# EAGLE design birthdaydisplay (EAGLE 6.5.0)
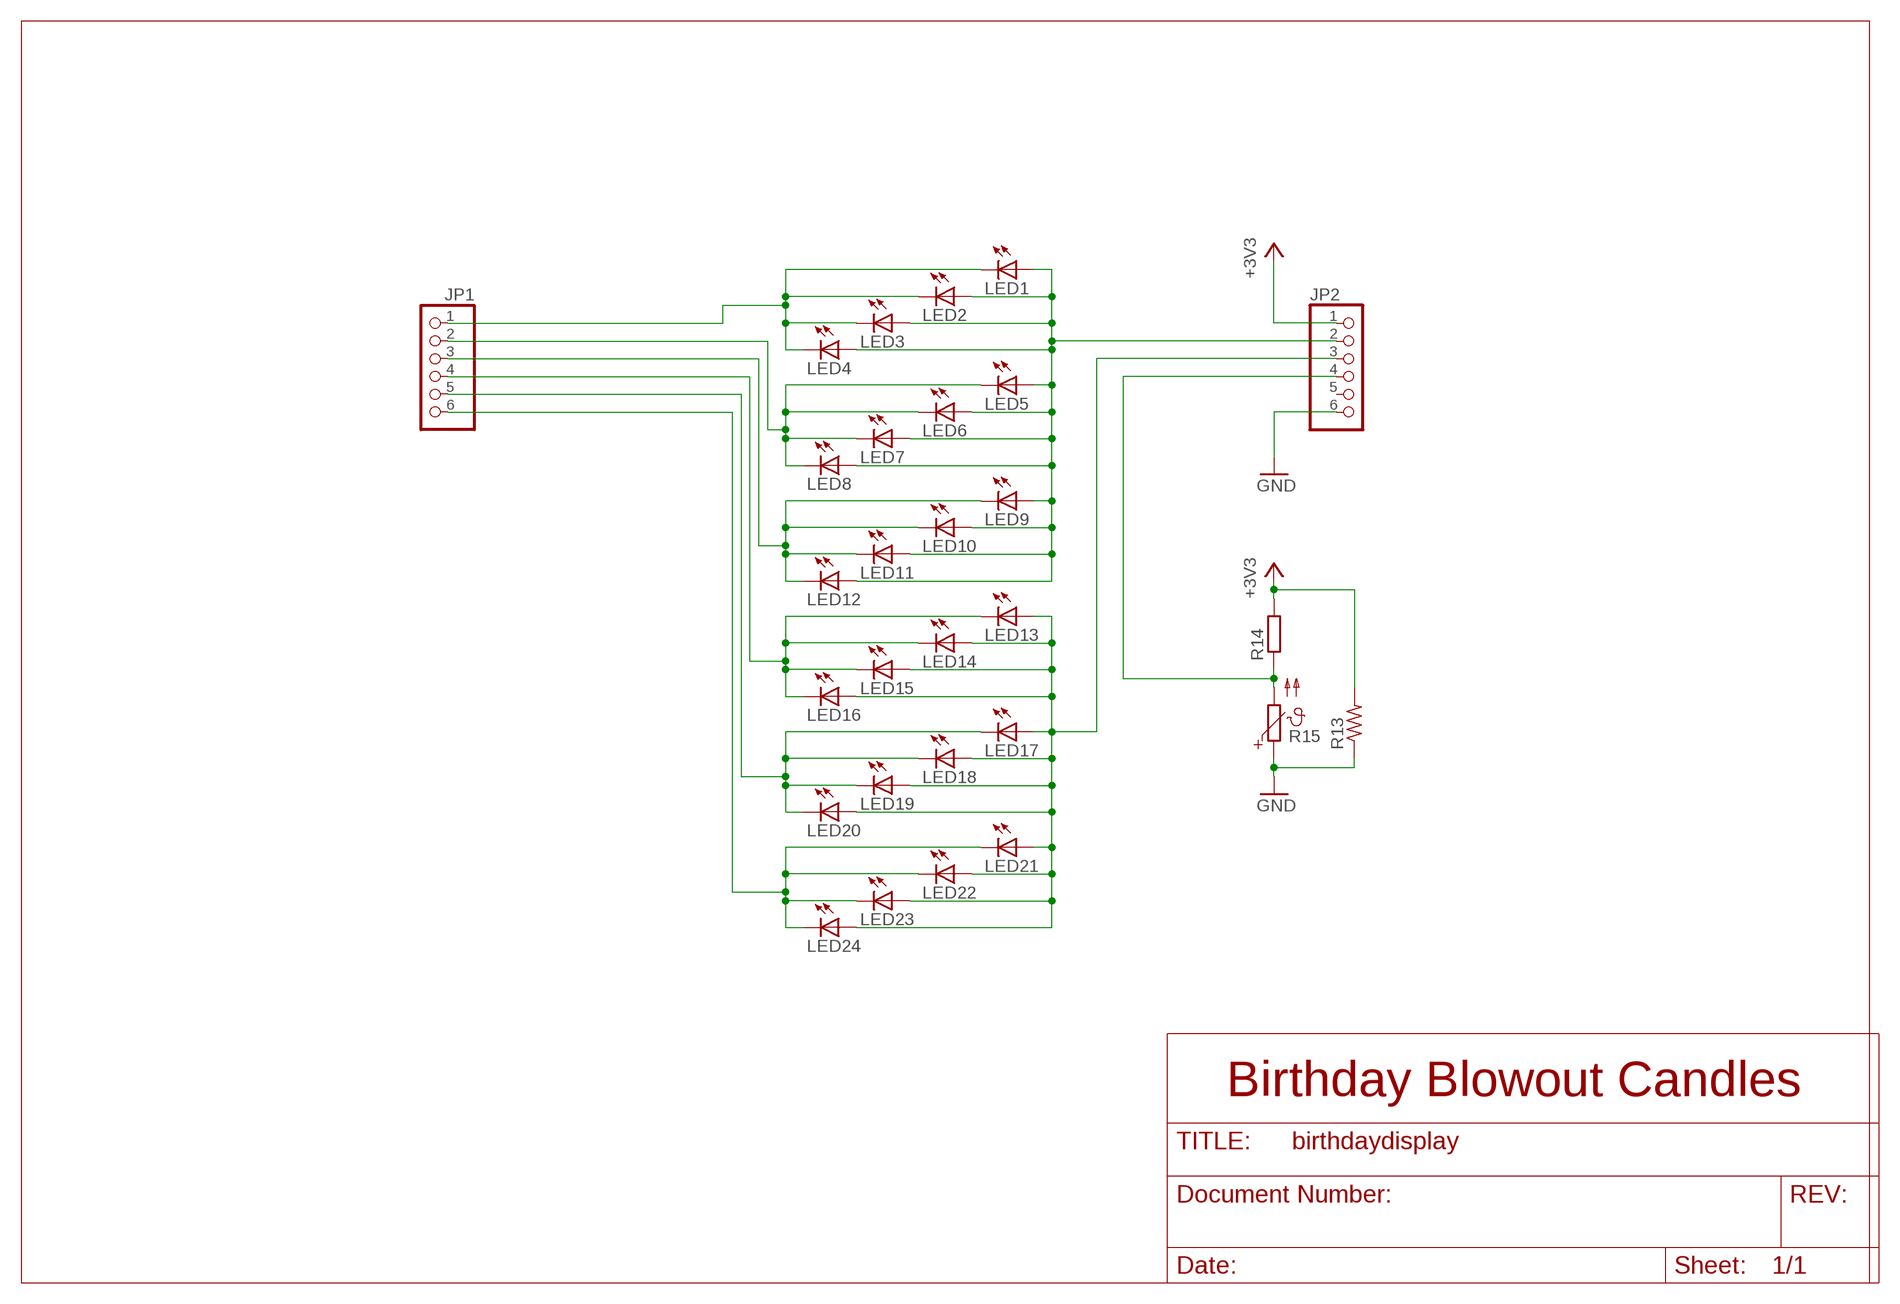
[diagram p0: schematic, sheet 1]

## Parts
JP1  PINHD-1X6  [1X06]
JP2  PINHD-1X6  [1X06]
LED1  LED3MM  [LED3MM]
LED2  LED3MM  [LED3MM]
LED3  LED3MM  [LED3MM]
LED4  LED3MM  [LED3MM]
LED5  LED3MM  [LED3MM]
LED6  LED3MM  [LED3MM]
LED7  LED3MM  [LED3MM]
LED8  LED3MM  [LED3MM]
LED9  LED3MM  [LED3MM]
LED10  LED3MM  [LED3MM]
LED11  LED3MM  [LED3MM]
LED12  LED3MM  [LED3MM]
LED13  LED3MM  [LED3MM]
LED14  LED3MM  [LED3MM]
LED15  LED3MM  [LED3MM]
LED16  LED3MM  [LED3MM]
LED17  LED3MM  [LED3MM]
LED18  LED3MM  [LED3MM]
LED19  LED3MM  [LED3MM]
LED20  LED3MM  [LED3MM]
LED21  LED3MM  [LED3MM]
LED22  LED3MM  [LED3MM]
LED23  LED3MM  [LED3MM]
LED24  LED3MM  [LED3MM]
R13  R-US_0207/10  [0207/10]
R14  R-EU_0207/7  [0207/7]
R15  PTC679  [P679]

## Nets
+3V3: JP2.1 R13.2 R14.2
GND: JP2.6 R13.1 R15.1
N$24: JP1.4 LED13.K(C) LED14.K(C) LED15.K(C) LED16.K(C)
N$28: JP2.4 R14.1 R15.2
N$33: JP1.1 LED1.K(C) LED2.K(C) LED3.K(C) LED4.K(C)
N$35: JP1.2 LED5.K(C) LED6.K(C) LED7.K(C) LED8.K(C)
N$36: JP2.2 LED1.A LED2.A LED3.A LED4.A LED5.A LED6.A LED7.A LED8.A LED9.A LED10.A LED11.A LED12.A
N$37: JP1.3 LED9.K(C) LED10.K(C) LED11.K(C) LED12.K(C)
N$39: JP1.5 LED17.K(C) LED18.K(C) LED19.K(C) LED20.K(C)
N$40: JP2.3 LED13.A LED14.A LED15.A LED16.A LED17.A LED18.A LED19.A LED20.A LED21.A LED22.A LED23.A LED24.A
N$41: JP1.6 LED21.K(C) LED22.K(C) LED23.K(C) LED24.K(C)
Unconnected: JP2.5

## Notes on the sheet
- Birthday Blowout Candles

## Library data of the parts
JP1 JP2 = pinhead01:PINHD-1X6: PIN HEADER
LED1-LED24 = led:LED: LED OSRAM: - CHIPLED LG R971, LG N971, LY N971, LG Q971, LY Q971, LO R971, LY R971 LH N974, LH R974 LS Q976, LO Q976, LY Q976 LO Q996 - Hyper CHIPLED LW Q18S LB Q993, LB Q99A, LB R99A - SideLED LS A670, LO A670, LY A670, LG A670, LP A670 LB A673, LV A673, LT A673, LW A673 LH A674 LY A675 LS A676, LA A676, LO A676, LY A676, LW A676 LS A679, LY A679, LG A679 - Hyper Micro SIDELED® LS Y876, LA Y876, LO Y876, LY Y876 LT Y87S - SmartLED LW L88C, LW L88S LB L89C, LB L89S, LG L890 LS L89K, LO L89K, LY L89K LS L896, LA L896, LO L896, LY L896 - TOPLED LS T670, LO T670, LY T670, LG T670, LP T670 LSG T670, LSP T670, LSY T670, LOP T670, LYG T670 LG T671, LOG T671, LSG T671 LB T673, LV T673, LT T673, LW T673 LH T674 LS T676, LA T676, LO T676, LY T676, LB T676, LH T676, LSB T676, LW T676 LB T67C, LV T67C, LT T67C, LS T67K, LO T67K, LY T67K, LW E67C LS E67B, LA E67B, LO E67B, LY E67B, LB E67C, LV E67C, LT E67C LW T67C LS T679, LY T679, LG T679 LS T770, LO T770, LY T770, LG T770, LP T770 LB T773, LV T773, LT T773, LW T773 LH T774 LS E675, LA E675, LY E675, LS T675 LS T776, LA T776, LO T776, LY T776, LB T776 LHGB T686 LT T68C, LB T68C - Hyper Mini TOPLED® LB M676 - Mini TOPLED Santana® LG M470 LS M47K, LO M47K, LY M47K Source: http://www.osram.convergy.de LUXEON: - LUMILED® LXK2-PW12-R00, LXK2-PW12-S00, LXK2-PW14-U00, LXK2-PW14-V00 LXK2-PM12-R00, LXK2-PM12-S00, LXK2-PM14-U00 LXK2-PE12-Q00, LXK2-PE12-R00, LXK2-PE12-S00, LXK2-PE14-T00, LXK2-PE14-U00 LXK2-PB12-K00, LXK2-PB12-L00, LXK2-PB12-M00, LXK2-PB14-N00, LXK2-PB14-P00, LXK2-PB14-Q00 LXK2-PR12-L00, LXK2-PR12-M00, LXK2-PR14-Q00, LXK2-PR14-R00 LXK2-PD12-Q00, LXK2-PD12-R00, LXK2-PD12-S00 LXK2-PH12-R00, LXK2-PH12-S00 LXK2-PL12-P00, LXK2-PL12-Q00, LXK2-PL12-R00 Source: www.luxeon.com KINGBRIGHT: KA-3528ASYC Source: www.kingbright.com
R13 = rcl:R-US_: RESISTOR, American symbol
R14 = rcl:R-EU_: RESISTOR, European symbol
R15 = ptc-ntc:PTC679: PHILIPS PTC; OC_FARNELL: unknown; OC_NEWARK: unknown

## Board
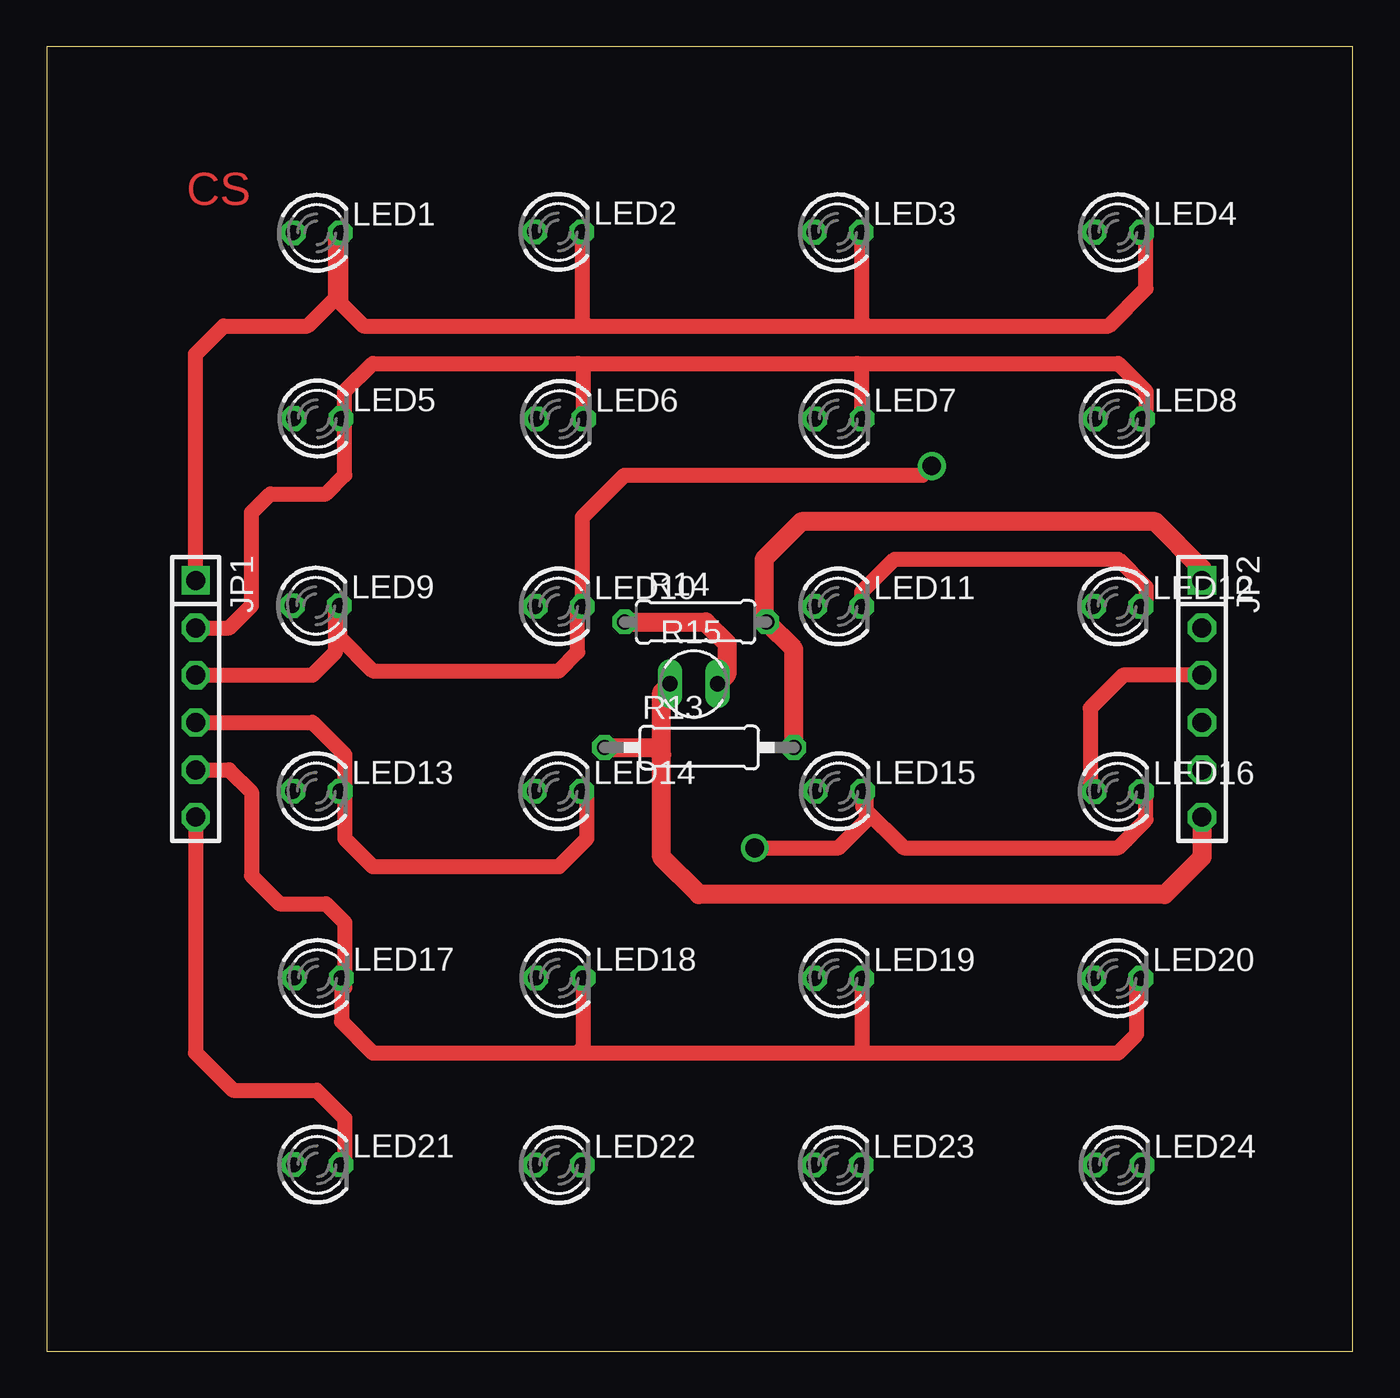
[diagram p1: board, top side]
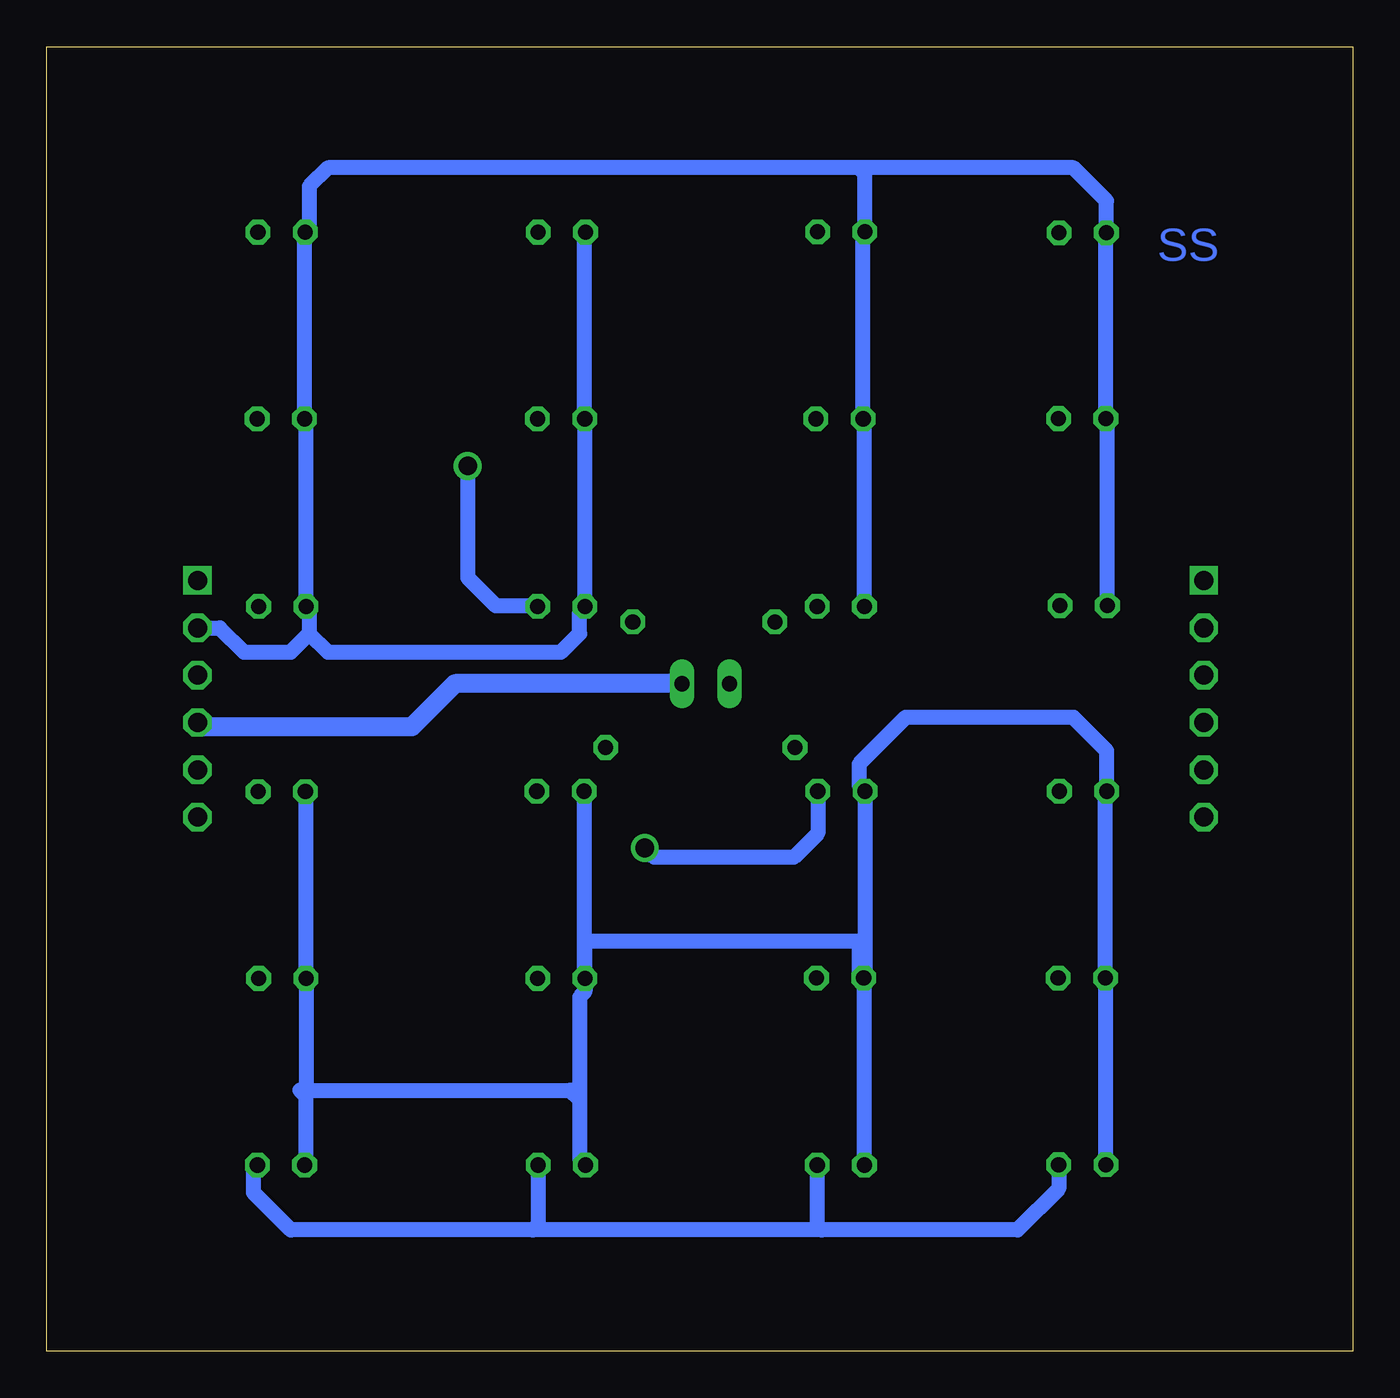
[diagram p2: board, bottom side, seen from below]

Size 70.1 x 70 mm. Coordinates in mm from the lower left corner, seen from the top.
Outline: 0,0 70.1,0 70.1,70 0,70 0,0
Copper layers (1*16): Top 0.035mm / dielectric 1.5mm / Bottom 0.035mm
Design rules "default": minimum track width 10mil, minimum drill 24mil, track to track 8mil, track to pad 8mil, pad to pad 8mil, via to via 8mil, smd to smd 8mil, copper to edge 40mil, drill to drill 8mil, minimum pad ring 10mil, minimum via ring 8mil, stop-mask expansion 4mil, vias tented up to drill 0mil, thermal gap 10mil

### Footprints (pad centres in the part's own frame; a part is rotated, then mirrored left to right if it is on the bottom)
1X06 = drill 1.016 square: 1 -6.35,0 | drill 1.016 octagon: 2 -3.81,0; 3 -1.27,0; 4 1.27,0; 5 3.81,0; 6 6.35,0
LED3MM = drill 0.813 octagon: A -1.27,0; K 1.27,0
0207/10 = drill 0.813 octagon: 1 -5.08,0; 2 5.08,0
0207/7 = drill 0.813 octagon: 1 -3.81,0; 2 3.81,0
P679 = drill 0.813 long: 1 -1.27,0; 2 1.27,0

### Placement (x,y rotation side)
JP1  8,35 270 top
JP2  62,35 270 top
LED1  14.5,60.01 0 top
LED2  27.46,60.06 0 top
LED3  42.45,60.04 0 top
LED4  57.49,60.04 0 top
LED5  14.53,50.04 0 top
LED6  27.55,50.02 0 top
LED7  42.49,50.02 0 top
LED8  57.53,50.02 0 top
LED9  14.45,40 0 top
LED10  27.48,39.96 0 top
LED11  42.48,39.96 0 top
LED12  57.45,39.96 0 top
LED13  14.48,30.04 0 top
LED14  27.45,30.04 0 top
LED15  42.52,30.04 0 top
LED16  57.48,30.02 0 top
LED17  14.55,20.02 0 top
LED18  27.52,20.02 0 top
LED19  42.48,20 0 top
LED20  57.45,20 0 top
LED21  14.52,10 0 top
LED22  27.48,9.98 0 top
LED23  42.45,9.98 0 top
LED24  57.52,9.98 0 top
R13  35.02,32.39 0 top
R14  34.83,39.13 0 top
R15  34.73,35.81 0 top

### Tracks (layer width: path | path; a pad name or v marks a point on that pad's centre or on a via)
+3V3
  Top 1.016: R13.2 40.1,37.67 R14.2 38.5,39.27 38.5,42.5 40.5,44.5 59.5,44.5 62,42 JP2.1
GND
  Top 1.016: JP2.6 62,26.5 60,24.5 35,24.5 33,26.5 33,32 | 33,32 33,35.35 R15.1 | R13.1 32.61,32.39 33,32
N$24  (via drill 1)
  Top 0.813: JP1.4 14.27,33.73 16,32 16,30.29 | 16,30.29 LED13.K | 16,30.29 16,27.5 17.5,26 27.5,26 29,27.5 29,29.76 LED14.K | v38,27 42.5,27 44,28.5 44,29.83 LED15.K 43.79,29.21 46,27 57.5,27 59,28.5 59,29.77 LED16.K
  Bottom 0.813: LED14.K 28.72,27.78 30,26.5 37.5,26.5 v38,27
N$28
  Top 1.016: R14.1 35.37,39.13 36.5,38 36.5,36.31 R15.2
  Bottom 1.016: R15.2 48.19,35.81 50.5,33.5 61.77,33.5 JP2.4
N$33
  Top 0.813: JP1.1 8,53.5 9.5,55 14,55 15.5,56.5 15.5,59.74 LED1.K 15.77,56.23 17,55 29,55 | 29,55 44,55 | 44,55 57,55 59,57 59,59.8 LED4.K | LED3.K 43.72,55.28 44,55 | LED2.K 28.73,55.27 29,55
N$35
  Top 0.813: JP1.2 9.81,38.81 11,40 11,45 12,46 15,46 16,47 16,49.84 | 16,49.84 LED5.K | 16,49.84 16,51.5 17.5,53 28.5,53 | 28.5,53 43.5,53 | 43.5,53 57.5,53 59,51.5 59,50.22 LED8.K | LED7.K 43.76,52.74 43.5,53 | LED6.K 28.82,52.68 28.5,53
N$36
  Bottom 0.813: JP2.2 60.81,38.81 59.5,37.5 57,37.5 56,38.5 | 56,38.5 56,39.78 LED12.A 56.18,49.94 LED8.A 56.26,60 LED4.A 56,60.26 56,62.5 55,63.5 26.5,63.5 | 56,38.5 55,37.5 42.5,37.5 41.5,38.5 41.5,39.67 LED11.A LED7.A 41.22,60 LED3.A | LED10.A 26.21,49.95 LED6.A 26.28,59.97 LED2.A 26.19,63.19 26.5,63.5 | LED9.A 13.18,49.96 LED5.A 13.26,59.98 LED1.A 13.23,61.73 15,63.5 26.5,63.5
N$37  (via drill 1)
  Top 0.813: JP1.3 14.27,36.27 15.5,37.5 15.5,39.78 LED9.K 15.72,38.28 17.5,36.5 27.5,36.5 28.5,37.5 28.5,39.71 LED10.K 28.75,44.75 31,47 47,47 v47.5,47.5 | LED11.K 43.75,40.75 45.5,42.5 57.5,42.5 59,41 59,40.24 LED12.K
  Bottom 0.813: v47.5,47.5 47.5,41.5 46,40 43.79,40 LED11.K
N$39
  Top 0.813: JP1.5 9.81,31.19 11,30 11,25.5 12.5,24 15,24 16,23 16,19.84 | 16,19.5 16,19.84 | 16,19.84 LED17.K 15.82,17.68 17.5,16 28.5,16 | 28.5,16 44,16 | 44,16 57.5,16 58.5,17 58.5,19.78 LED20.K | LED18.K 28.79,16.29 28.5,16 | LED19.K 43.75,16.25 44,16
N$40
  Top 0.813: JP2.3 57.77,36.27 56,34.5 56,30.23 LED16.A
  Bottom 0.813: LED21.A 13.25,19.99 LED17.A 13.28,29.97 LED13.A 13.21,32.21 15,34 24,34 26.5,31.5 26.5,30.36 LED14.A 26.18,20.09 LED18.A | LED18.A 26.25,10.02 LED22.A | LED15.A 41.25,20.04 LED19.A | LED19.A 41.21,19.29 41.5,19 41.5,13.5 | 41.5,13.5 41.5,10.3 LED23.A | LED16.A 56.21,20.03 LED20.A 56.18,13.68 | LED24.A 56.18,10.05 56.18,13.68 | LED19.A 41.21,21.79 41,22 26.5,22 26.5,20.27 LED18.A | 56.18,13.68 56.5,14 42,14 41.5,13.5
N$41
  Top 0.813: JP1.6 8,16 10,14 14.5,14 16,12.5 16,10.21 LED21.K
  Bottom 0.813: LED21.K 15.79,8.71 18,6.5 28.5,6.5 | 28.5,6.5 44,6.5 | 44,6.5 57,6.5 59,8.5 59,9.77 LED24.K | LED23.K 43.72,6.78 44,6.5 | LED22.K 28.75,6.75 28.5,6.5

### Text on the board
Top: CS
Bottom: SS
tValues: BIRTHDAY BLOWOUT CANDLES